# Altium schematic sheet Sensors.SchDoc
size A4
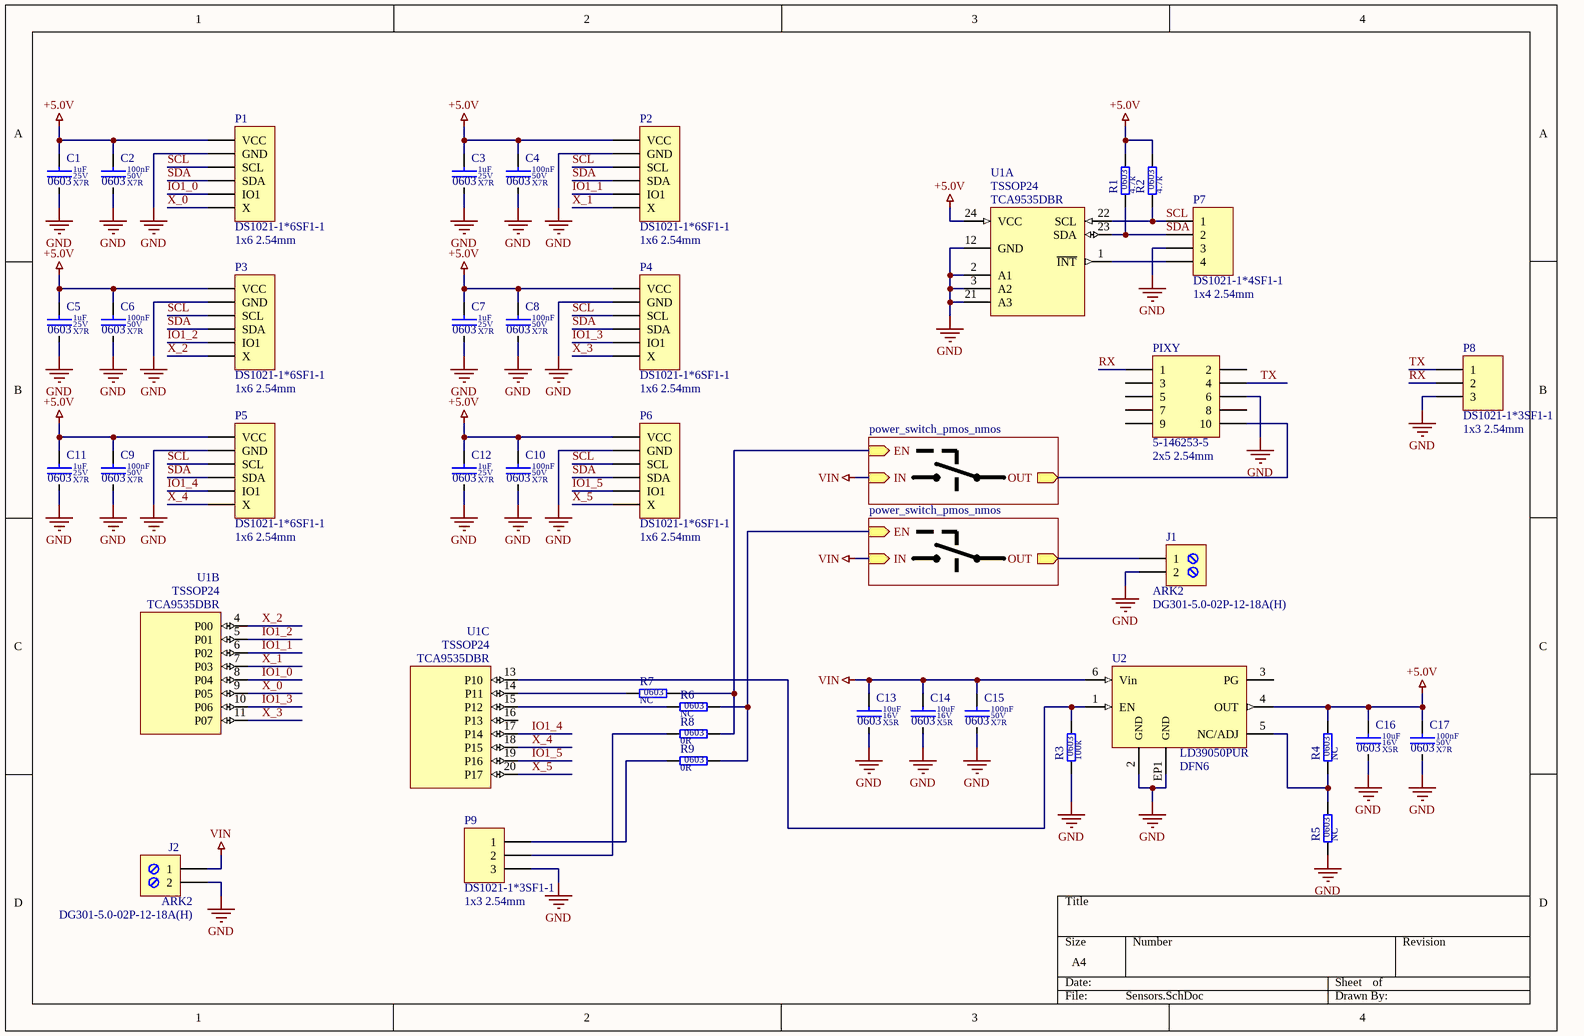
[diagram p0: Sensors.SchDoc]

## Parts
C1  value 1uF  Dielectric: X7R  Voltage: 25V  SCH_Footprint: 0603  [C_0603_1608]  (hidden comment: Ceramic X7R)
C2  value 100nF  Dielectric: X7R  Voltage: 50V  SCH_Footprint: 0603  [C_0603_1608]  (hidden comment: Ceramic X7R)
C3  value 1uF  Dielectric: X7R  Voltage: 25V  SCH_Footprint: 0603  [C_0603_1608]  (hidden comment: Ceramic X7R)
C4  value 100nF  Dielectric: X7R  Voltage: 50V  SCH_Footprint: 0603  [C_0603_1608]  (hidden comment: Ceramic X7R)
C5  value 1uF  Dielectric: X7R  Voltage: 25V  SCH_Footprint: 0603  [C_0603_1608]  (hidden comment: Ceramic X7R)
C6  value 100nF  Dielectric: X7R  Voltage: 50V  SCH_Footprint: 0603  [C_0603_1608]  (hidden comment: Ceramic X7R)
C7  value 1uF  Dielectric: X7R  Voltage: 25V  SCH_Footprint: 0603  [C_0603_1608]  (hidden comment: Ceramic X7R)
C8  value 100nF  Dielectric: X7R  Voltage: 50V  SCH_Footprint: 0603  [C_0603_1608]  (hidden comment: Ceramic X7R)
C9  value 100nF  Dielectric: X7R  Voltage: 50V  SCH_Footprint: 0603  [C_0603_1608]  (hidden comment: Ceramic X7R)
C10  value 100nF  Dielectric: X7R  Voltage: 50V  SCH_Footprint: 0603  [C_0603_1608]  (hidden comment: Ceramic X7R)
C11  value 1uF  Dielectric: X7R  Voltage: 25V  SCH_Footprint: 0603  [C_0603_1608]  (hidden comment: Ceramic X7R)
C12  value 1uF  Dielectric: X7R  Voltage: 25V  SCH_Footprint: 0603  [C_0603_1608]  (hidden comment: Ceramic X7R)
C13  value 10uF  Dielectric: X5R  Voltage: 16V  SCH_Footprint: 0603  [C_0603_1608]  (hidden comment: Ceramic X5R)
C14  value 10uF  Dielectric: X5R  Voltage: 16V  SCH_Footprint: 0603  [C_0603_1608]  (hidden comment: Ceramic X5R)
C15  value 100nF  Dielectric: X7R  Voltage: 50V  SCH_Footprint: 0603  [C_0603_1608]  (hidden comment: Ceramic X7R)
C16  value 10uF  Dielectric: X5R  Voltage: 16V  SCH_Footprint: 0603  [C_0603_1608]  (hidden comment: Ceramic X5R)
C17  value 100nF  Dielectric: X7R  Voltage: 50V  SCH_Footprint: 0603  [C_0603_1608]  (hidden comment: Ceramic X7R)
J1  value DG301-5.0-02P-12-18A(H)  [J_ARK2]  (hidden comment: ARK2)
J2  value DG301-5.0-02P-12-18A(H)  [J_ARK2]  (hidden comment: ARK2)
P1  value DS1021-1*6SF1-1  SCH_Footprint: 1x6 2.54mm  [P_HEADER_1x6_2.54]  (hidden comment: Goldpin)
P2  value DS1021-1*6SF1-1  SCH_Footprint: 1x6 2.54mm  [P_HEADER_1x6_2.54]  (hidden comment: Goldpin)
P3  value DS1021-1*6SF1-1  SCH_Footprint: 1x6 2.54mm  [P_HEADER_1x6_2.54]  (hidden comment: Goldpin)
P4  value DS1021-1*6SF1-1  SCH_Footprint: 1x6 2.54mm  [P_HEADER_1x6_2.54]  (hidden comment: Goldpin)
P5  value DS1021-1*6SF1-1  SCH_Footprint: 1x6 2.54mm  [P_HEADER_1x6_2.54]  (hidden comment: Goldpin)
P6  value DS1021-1*6SF1-1  SCH_Footprint: 1x6 2.54mm  [P_HEADER_1x6_2.54]  (hidden comment: Goldpin)
P7  value DS1021-1*4SF1-1  SCH_Footprint: 1x4 2.54mm  [P_HEADER_1x4_2.54]  (hidden comment: Goldpin)
P8  value DS1021-1*3SF1-1  SCH_Footprint: 1x3 2.54mm  [P_HEADER_1x3_2.54]  (hidden comment: Goldpin)
P9  value DS1021-1*3SF1-1  SCH_Footprint: 1x3 2.54mm  [P_HEADER_1x3_2.54]  (hidden comment: Goldpin)
PIXY  value 5-146253-5  SCH_Footprint: 2x5 2.54mm  [P_HEADER_2x5_2.54]  (hidden comment: Goldpin)
R1  value 4.7k  SCH_Footprint: 0603  [R_0603_1608]  (hidden comment: Resistor)
R2  value 4.7k  SCH_Footprint: 0603  [R_0603_1608]  (hidden comment: Resistor)
R3  value 100k  SCH_Footprint: 0603  [R_0603_1608]  (hidden comment: Resistor)
R4  value NC  SCH_Footprint: 0603  [R_NC_0603_1608]  (hidden comment: Resistor)
R5  value NC  SCH_Footprint: 0603  [R_NC_0603_1608]  (hidden comment: Resistor)
R6  value NC  SCH_Footprint: 0603  [R_NC_0603_1608]  (hidden comment: Resistor)
R7  value NC  SCH_Footprint: 0603  [R_NC_0603_1608]  (hidden comment: Resistor)
R8  value 0R  SCH_Footprint: 0603  [R_0603_1608]  (hidden comment: Resistor)
R9  value 0R  SCH_Footprint: 0603  [R_0603_1608]  (hidden comment: Resistor)
U1  value TCA9535DBR  SCH_Footprint: TSSOP24  [TSSOP24_8x8]  (hidden comment: 5 Low-Voltage 16-Bit I2C and SMBus Low-Power I/O Expander with Interrupt Output and Configuration Registers)  (parts A,B,C of 3)
U2  SCH_Footprint: DFN6  [DFN6_3x3]  (hidden comment: LD39050PUR)

## Sub-sheets
U_power_switch_pmos_nmos = power_switch_pmos_nmos: IN (in), EN (in), OUT (out)
U_power_switch_pmos_nmos = power_switch_pmos_nmos: IN (in), EN (in), OUT (out)

## Nets
+5.0V: C1.1 C2.1 C3.1 C4.1 C5.1 C6.1 C7.1 C8.1 C9.1 C10.1 C11.1 C12.1 C16.1 C17.1 P1.1(VCC) P2.1(VCC) P3.1(VCC) P4.1(VCC) P5.1(VCC) P6.1(VCC) R1.2 R2.2 R4.2 U1.24(VCC) U2.4(OUT)
GND: C1.2 C2.2 C3.2 C4.2 C5.2 C6.2 C7.2 C8.2 C9.2 C10.2 C11.2 C12.2 C13.2 C14.2 C15.2 C16.2 C17.2 J1.2 J2.2 P1.2(GND) P2.2(GND) P3.2(GND) P4.2(GND) P5.2(GND) P6.2(GND) P7.3 P8.3 P9.3 PIXY.6 R3.1 R5.1 U1.2(A1) U1.3(A2) U1.12(GND) U1.21(A3) U2.2(GND) U2.EP1(GND)
VIN: C13.1 C14.1 C15.1 J2.1 U2.6(Vin) ; sheet U_power_switch_pmos_nmos/IN, sheet U_power_switch_pmos_nmos/IN
IO1_0: P1.5(IO1) U1.8(P04)
IO1_1: P2.5(IO1) U1.6(P02)
IO1_2: P3.5(IO1) U1.5(P01)
IO1_3: P4.5(IO1) U1.10(P06)
IO1_4: P5.5(IO1) U1.17(P14)
IO1_5: P6.5(IO1) U1.19(P16)
RX: P8.2 PIXY.1
SCL: P1.3(SCL) P2.3(SCL) P3.3(SCL) P4.3(SCL) P5.3(SCL) P6.3(SCL) P7.1 R2.1 U1.22(SCL)
SDA: P1.4(SDA) P2.4(SDA) P3.4(SDA) P4.4(SDA) P5.4(SDA) P6.4(SDA) P7.2 R1.1 U1.23(SDA)
TX: P8.1 PIXY.4
X_0: P1.6(X) U1.9(P05)
X_1: P2.6(X) U1.7(P03)
X_2: P3.6(X) U1.4(P00)
X_3: P4.6(X) U1.11(P07)
X_4: P5.6(X) U1.18(P15)
X_5: P6.6(X) U1.20(P17)
NetJ1_1: J1.1 ; sheet U_power_switch_pmos_nmos/OUT
NetP7_4: P7.4 U1.1(~{INT})
NetP9_1: P9.1 R9.1
NetP9_2: P9.2 R8.1
NetPIXY_10: PIXY.10 ; sheet U_power_switch_pmos_nmos/OUT
NetR3_2: R3.2 U1.13(P10) U2.1(EN)
NetR4_1: R4.1 R5.2 U2.5(NC/ADJ)
NetR6_1: R6.1 U1.15(P12)
NetR6_2: R6.2 R9.2 ; sheet U_power_switch_pmos_nmos/EN
NetR7_1: R7.1 U1.14(P11)
NetR7_2: R7.2 R8.2 ; sheet U_power_switch_pmos_nmos/EN

Not connected (* = marked no-connect by the designer): PIXY 2 3 5 7 8 9; U1 16(P13); U2 3(PG)

## Library data of the parts
C1 C3 C5 C7 C11 C12 = C_1uF_25V_X7R_0603_10: Capacitor; Manufacturer: Samsung; Manufacturer Part Number: CL10B105KA8NNNC; Tolerance (%): 10; Part Number: C_1uF_25V_X7R_0603_10; HelpURL: http://www.tme.eu/pl/Document/4a42202b32dab16128fe107dd69598cc/samsung-chip-cap.pdf; Supplier 1: TME; Supplier Part Number 1: CL10B105KA8NNNC; Supplier 2: RS Components; Supplier 3: Farnell; Supplier 4: Mouser; Supplier 5: Digi-Key
C2 C4 C6 C8-C10 C15 C17 = C_100nF_50V_X7R_0603_5: Capacitor; Manufacturer: Samsung; Manufacturer Part Number: CL10B104JB8NNNC; Tolerance (%): 5; Part Number: C_100nF_50V_X7R_0603_5; HelpURL: http://www.tme.eu/pl/Document/4a42202b32dab16128fe107dd69598cc/samsung-chip-cap.pdf; Supplier 1: TME; Supplier Part Number 1: CL10B104JB8NNNC; Supplier 2: RS Components; Supplier 3: Farnell; Supplier 4: Mouser; Supplier 5: Digi-Key
C13 C14 C16 = C_10uF_16V_X5R_0603_20: Capacitor; Manufacturer: Samsung Electro-Mechanics; Manufacturer Part Number: CL10A106MO8NQNC; Tolerance (%): 20; Part Number: C_10uF_16V_X5R_0603_20; HelpURL: http://www.tme.eu/pl/Document/4a42202b32dab16128fe107dd69598cc/samsung-chip-cap.pdf; Supplier 1: TME; Supplier Part Number 1: CL10A106MO8NQNC; Supplier 2: RS Components; Supplier 3: Farnell; Supplier 4: Mouser; Supplier 5: Digi-Key
J1 J2 = J_TB-5.0-P-2P: ARK Screw terminal, 2-Pin; Manufacturer: DEGSON ELECTRONICS; SCH_Footprint: ARK2; Part Number: J_TB-5.0-P-2P; Component Type: Standard; HelpURL: https://datasheet.octopart.com/DG301-5.0-03P-12-18A%28H%29-Degson-datasheet-17801202.pdf; Manufacturer Part Number: DG301-5.0-02P-12-18A(H); Supplier 1: TME; Supplier Part Number 1: DG301-5.0-2/6B; Supplier 2: RS Components; Supplier 3: Farnell; Supplier 4: Mouser; Supplier 5: Digi-Key
P1-P6 = P_HEADER_1x6_2.54: Header, 6-Pin; Manufacturer: Connfly; Part Number: P_HEADER_1x6_2.54; Component Type: Standard; HelpURL: http://www.tme.eu/en/Document/cc301e58a5da78cb543a94b5a5b7f06a/DS1021.pdf; Manufacturer Part Number: DS1021-1*6SF1-1; Supplier 1: TME; Supplier Part Number 1: ZL201-06G; Supplier 2: RS Components; Supplier 3: Farnell; Supplier 4: Mouser; Supplier 5: Digi-Key
P7 = P_HEADER_1x4_2.54: Header, 4-Pin; Manufacturer: Connfly; Part Number: P_HEADER_1x4_2.54; Component Type: Standard; HelpURL: http://datasheet.octopart.com/DS1021-1%2A4SF1-1-Connfly-datasheet-65537859.pdf; Manufacturer Part Number: DS1021-1*4SF1-1; Supplier 1: TME; Supplier Part Number 1: ZL201-04G; Supplier 2: RS Components; Supplier 3: Farnell; Supplier 4: Mouser; Supplier 5: Digi-Key
P8 P9 = P_HEADER_1x3_2.54: Header, 3-Pin; Manufacturer: Connfly; Part Number: P_HEADER_1x3_2.54; Component Type: Standard; HelpURL: http://www.tme.eu/en/Document/cc301e58a5da78cb543a94b5a5b7f06a/DS1021.pdf; Manufacturer Part Number: DS1021-1*3SF1-1; Supplier 1: TME; Supplier Part Number 1: ZL201-03G; Supplier 2: RS Components; Supplier 3: Farnell; Supplier 4: Mouser; Supplier 5: Digi-Key
PIXY = P_HEADER_2x5_2.54: Header, 10-Pin, Dual row; Manufacturer: TE Connectivity; Part Number: P_HEADER_2x5_2.54; Component Type: Standard; HelpURL: https://sigma.octopart.com/11631052/technical_drawing/TE-Connectivity-5-146253-5.pdf; Manufacturer Part Number: 5-146253-5; Supplier 1: TME; Supplier 2: RS Components; Supplier Part Number 2: 782-9205; Supplier 3: Farnell; Supplier Part Number 3: 2311131; Supplier 4: Mouser; Supplier Part Number 4: 571-5-146253-5; Supplier 5: Digi-Key; Supplier Part Number 5: A121461-ND
R1 R2 = R_4.7k_0603_1: Manufacturer: Yageo; Manufacturer Part Number: RC0603FR-074K7L; Voltage: 75V; Power: 100mW; Tolerance: 1%; Part Number: R_4.7k_0603_1; HelpURL: http://www.farnell.com/datasheets/2167052.pdf?_ga=2.156163131.1690599162.1548417389-1379097396.1542296996&_gac=1.18389067.1547230258.Cj0KCQiAmuHhBRD0ARIsAFWyPwhX8HcvXnM3tA0ZBodZLzDIjH2ZxLpjT5LWo9bad_HPRbU8LfPq44UaAhEwEALw_wcB; Supplier 1: TME; Supplier Part Number 1: RC0603FR-074K7; Supplier 2: RS Components; Supplier 3: Farnell; Supplier Part Number 3: 9238565; Supplier 4: Mouser; Supplier Part Number 4: 603-RC0603FR-074K7L; Supplier 5: Digi-Key; Supplier Part Number 5: 311-4.70KHRCT-ND
R3 = R_100k_0603_1: Manufacturer: Royalohm; Manufacturer Part Number: 0603SAF1003T5E; Voltage: 50V; Power: 100mW; Tolerance: 1%; Part Number: R_100k_0603_1; HelpURL: http://www.tme.eu/pl/Document/b315665a56acbc42df513c99b390ad98/ROYALOHM-THICKFILM.pdf; Supplier 1: TME; Supplier Part Number 1: SMD0603-100K-1%; Supplier 2: RS Components; Supplier 3: Farnell; Supplier 4: Mouser; Supplier Part Number 4: 667-ERJ-3EKF1003V; Supplier 5: Digi-Key; Supplier Part Number 5: P100KHCT-ND
R4-R7 = R_GENERIC_0603: Part Number: R_GENERIC_0603; Supplier 1: TME; Supplier 2: RS Components; Supplier 3: Farnell; Supplier 4: Mouser; Supplier 5: Digi-Key
R8 R9 = R_0R_0603_5: Manufacturer: Samsung; Manufacturer Part Number: RC1608J000CS; Voltage: 50V; Power: 100mW; Tolerance: 5%; Part Number: R_0R_0603_5; HelpURL: http://www.samsungsem.com/kr/support/product-search/chip-resistor/RC1608J000CS.jsp; Supplier 1: TME; Supplier 2: RS Components; Supplier 3: Farnell; Supplier 4: Mouser; Supplier 5: Digi-Key; Supplier Part Number 5: 1276-3510-1-ND
U1 = U_TCA9535DBR: Low-Voltage 16-Bit I2C and SMBus Low-Power I/O Expander with Interrupt Output and Configuration Registers; Manufacturer: Texas Instruments; Part Number: U_TCA9535DBR; HelpURL: http://www.ti.com/lit/ds/symlink/tca9535.pdf; Manufacturer Part Number: TCA9535DBR; Supplier 1: TME; Supplier 2: RS Components; Supplier 3: Farnell; Supplier Part Number 3: 2627594; Supplier 4: Mouser; Supplier Part Number 4: 595-TCA9535DBR; Supplier 5: Digi-Key; Supplier Part Number 5: 296-44625-1-ND
U2 = VL_LD39050PUR: Manufacturer: STMicroelectronics; Voltage: ADJ; Current: 500mA; Value: LD39050PUR; Part Number: VL_LD39050PUR; HelpURL: https://pl.mouser.com/datasheet/2/389/ld39050-974080.pdf; Manufacturer Part Number: LD39050PUR; Supplier 1: TME; Supplier Part Number 1: LD39050PUR; Supplier 2: RS Components; Supplier Part Number 2: 8805317; Supplier 3: Farnell; Supplier Part Number 3: 2762704; Supplier 4: Mouser; Supplier Part Number 4: 511-LD39050PUR; Supplier 5: Digi-Key; Supplier Part Number 5: 497-8717-1-ND